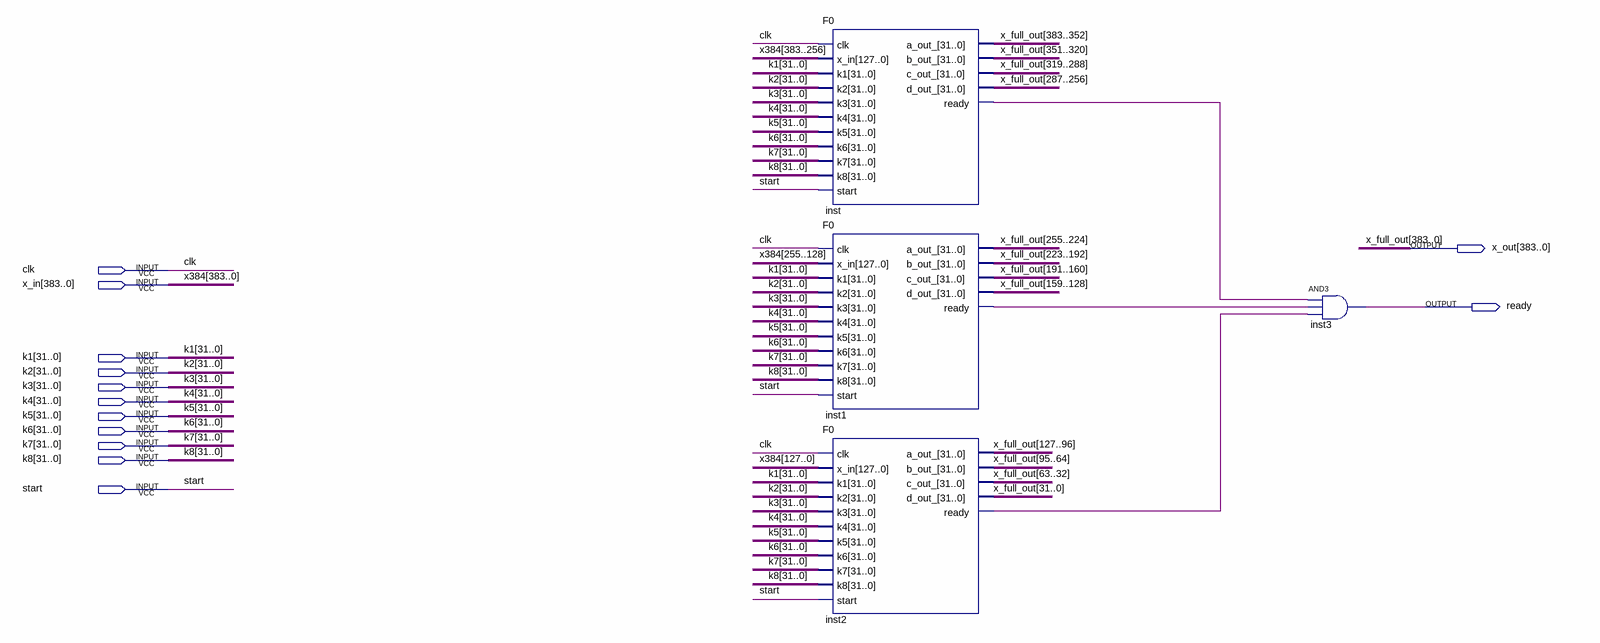
[diagram p0: schematic sheet]
// Quartus schematic full_simple_f.bdf as structural Verilog: 4 symbols, 13 pins
module full_simple_f (
  input  clk,
  input  [383:0] x_in,
  input  [31:0] k1,
  input  [31:0] k2,
  input  [31:0] k3,
  input  [31:0] k4,
  input  [31:0] k5,
  input  [31:0] k6,
  input  [31:0] k7,
  input  [31:0] k8,
  input  start,
  output [383:0] x_out,
  output ready
);

  wire inst1_ready, inst2_ready, inst_ready;

  F0 inst (
    .clk(clk), .x_in(x_in[383:256]), .k1(k1), .k2(k2), .k3(k3), .k4(k4), .k5(k5), .k6(k6), .k7(k7), .k8(k8),
    .start(start), .a_out_(x_out[383:352]), .b_out_(x_out[351:320]), .c_out_(x_out[319:288]),
    .d_out_(x_out[287:256]), .ready(inst_ready));
  F0 inst1 (
    .clk(clk), .x_in(x_in[255:128]), .k1(k1), .k2(k2), .k3(k3), .k4(k4), .k5(k5), .k6(k6), .k7(k7), .k8(k8),
    .start(start), .a_out_(x_out[255:224]), .b_out_(x_out[223:192]), .c_out_(x_out[191:160]),
    .d_out_(x_out[159:128]), .ready(inst1_ready));
  F0 inst2 (
    .clk(clk), .x_in(x_in[127:0]), .k1(k1), .k2(k2), .k3(k3), .k4(k4), .k5(k5), .k6(k6), .k7(k7), .k8(k8),
    .start(start), .a_out_(x_out[127:96]), .b_out_(x_out[95:64]), .c_out_(x_out[63:32]),
    .d_out_(x_out[31:0]), .ready(inst2_ready));
  and inst3 (ready, inst_ready, inst1_ready, inst2_ready);

  // Other names for the same wires on the sheet: x384[383:0] = x_in; x_full_out[383:0] = x_out
endmodule
